# EAGLE design M5_Access_Switch_Output (EAGLE 9.6.2)
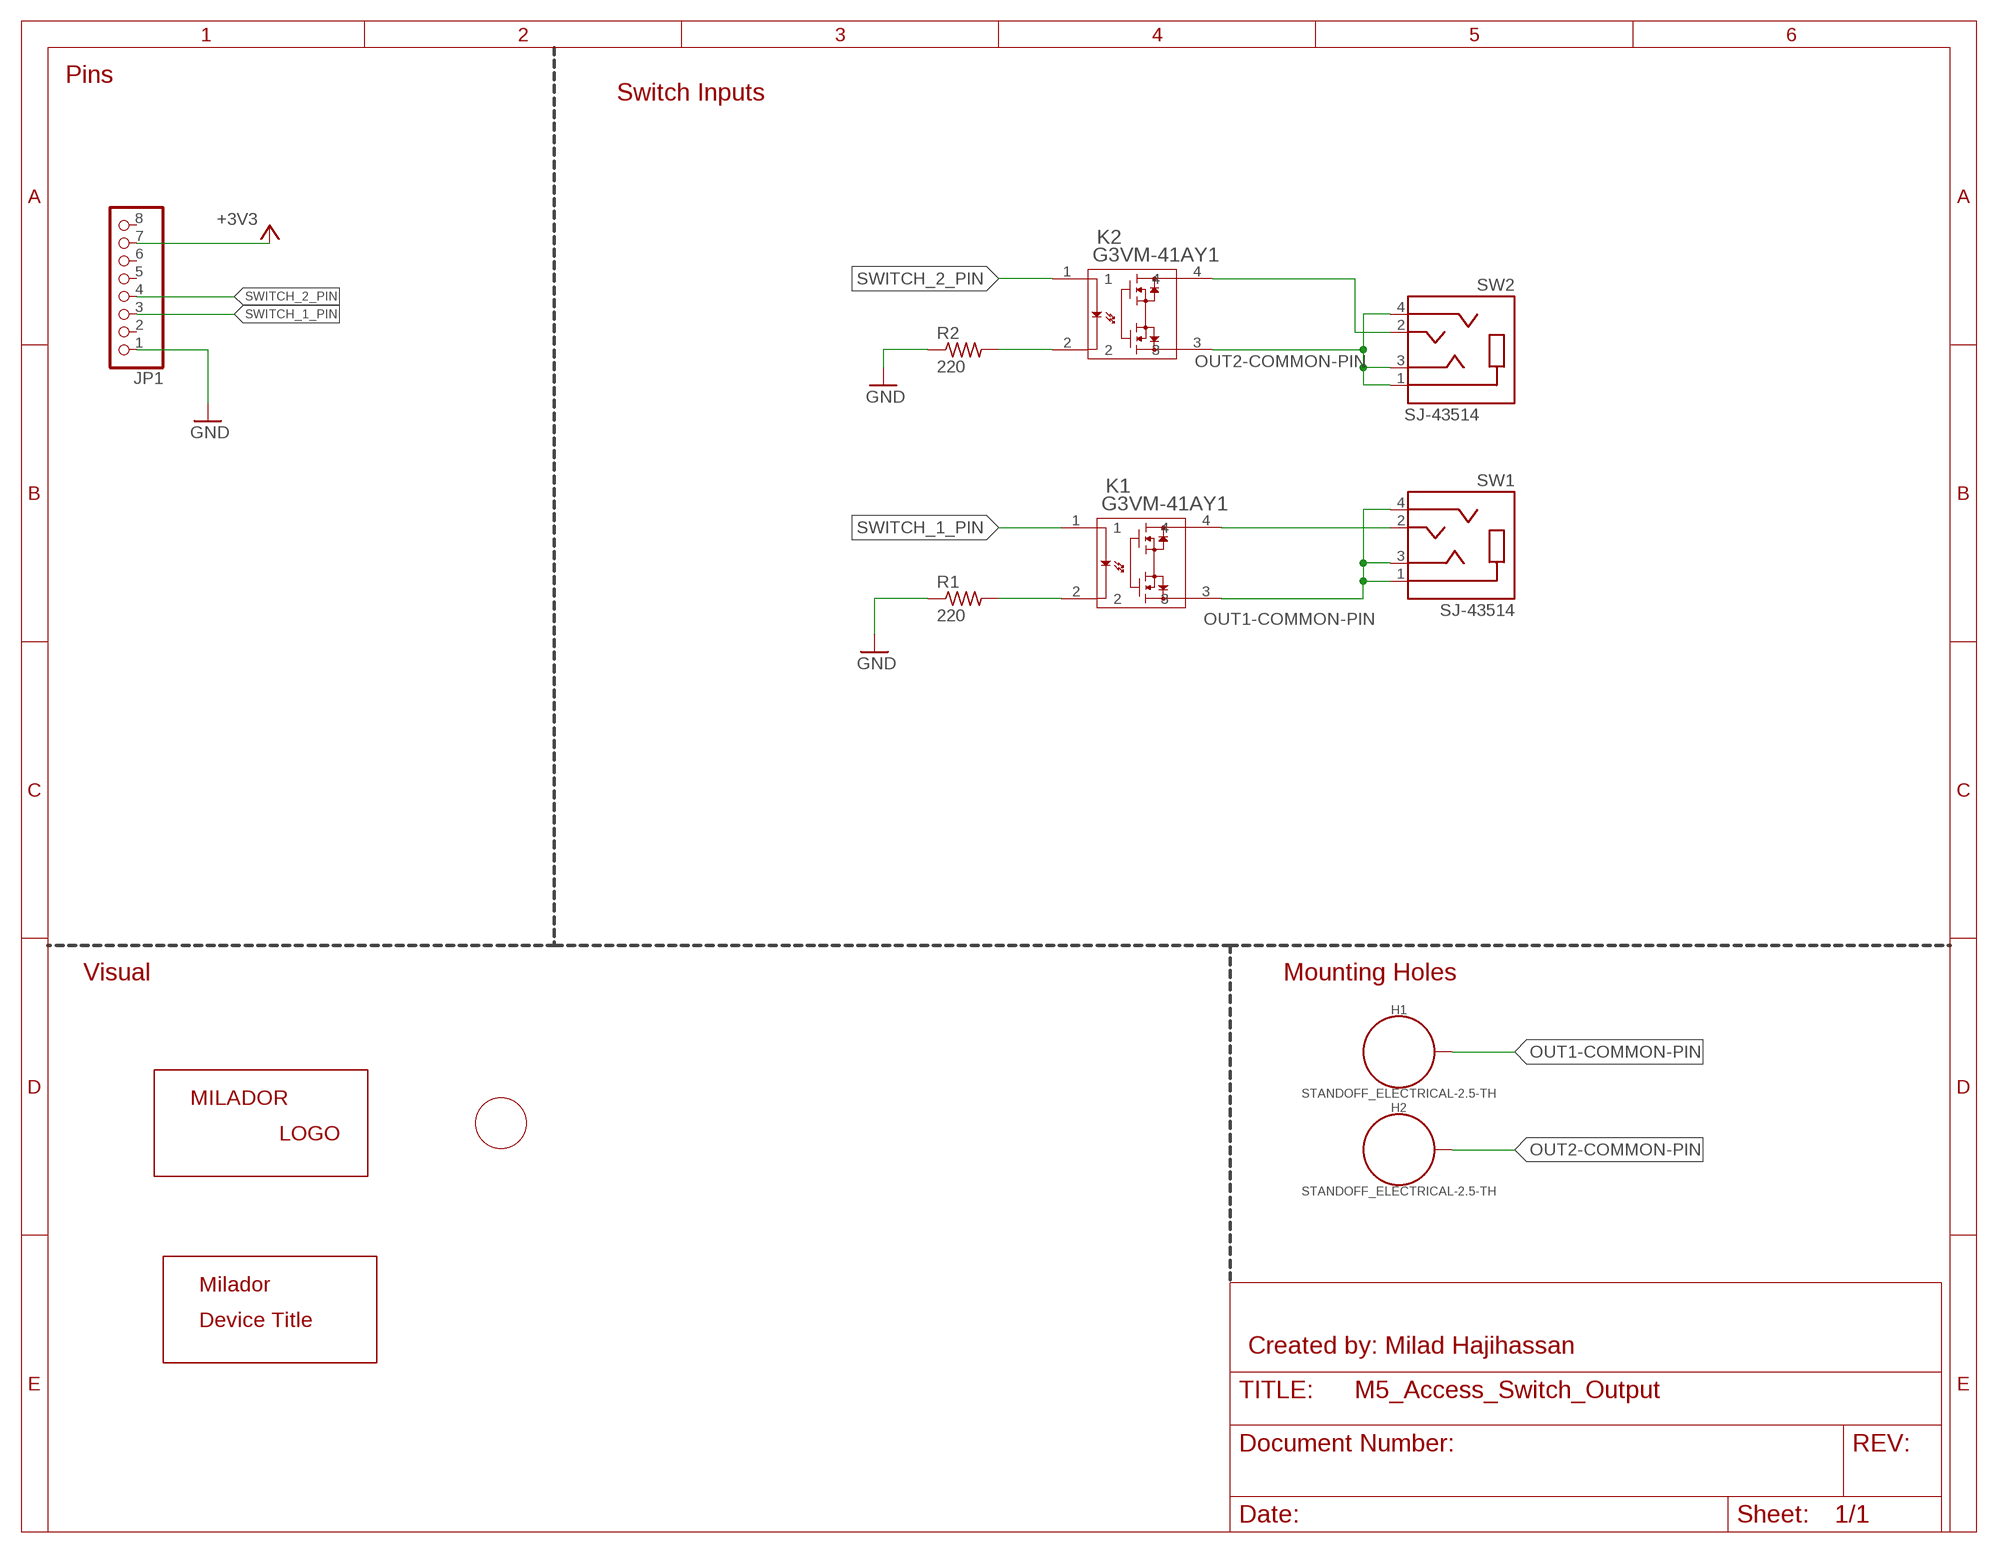
[diagram p0: schematic, sheet 1]

## Parts
H1  STANDOFF_ELECTRICAL-2.5-TH  [STANDOFF-ELECTRICAL-2.5-TH]
H2  STANDOFF_ELECTRICAL-2.5-TH  [STANDOFF-ELECTRICAL-2.5-TH]
JP1  HEADER_MALE-1X8ROUND-RA  [1X08_ROUND_RA]
K1  G3VM-41AY1  [A-DIP4_THD_OMR]
K2  G3VM-41AY1  [A-DIP4_THD_OMR]
LABEL_DEVICE_TOP  MILADOR-DEVICE-M5-ACCESS-SWITCH  [MILADOR_M5_ACCESS_SWITCH]
LABEL_LOGO_TOP  MILADOR-LOGO-SM  [MILADOR_LOGO2]
LABEL_OUTPUT_TOP  MILADOR-SWITCH-NAME-SW-OUTPUT  [SWITCH-OUTPUT]
R1  220  RESISTOR-US-0204/5  [RESISTOR_0204/5]
R2  220  RESISTOR-US-0204/5  [RESISTOR_0204/5]
SW1  SJ-43514  [CUI_SJ-43514]
SW2  SJ-43514  [CUI_SJ-43514]

## Nets
+3V3: JP1.7
GND: JP1.1 R1.1 R2.1
N$2: K2.2 R2.2
N$3: K1.2 R1.2
OUT1-COMMON-PIN: H1.P1 K1.3 SW1.1(SLEEVE) SW1.3(RING1) SW1.4(RING2)
OUT2-COMMON-PIN: H2.P1 K2.3 SW2.1(SLEEVE) SW2.3(RING1) SW2.4(RING2)
OUT-1-PIN: K2.4 SW2.2(TIP)
OUT-2-PIN: K1.4 SW1.2(TIP)
SWITCH_1_PIN: JP1.3 K1.1
SWITCH_2_PIN: JP1.4 K2.1
Unconnected: JP1.2 JP1.5 JP1.6 JP1.8

## Notes on the sheet
- Pins
- Switch Inputs
- Visual | Mounting Holes
- Created by: Milad Hajihassan

## Library data of the parts
H1 H2 = milador:STANDOFF_ELECTRICAL: Stand Off Drill holes with an electrical connection. For example, use these to ground your board to a chassis. Example SparkFun Products Screw - Phillips Head (1/4", 4-40, 10 pack) <https://www.sparkfun.com/products/10453> (PRT-10453) Screw - Phillips Head (1/2", 4-40, 10 pack) <https://www.sparkfun.com/products/10452> (PRT-10452) Screw - Phillips Head (3/4", 4-40, 10 pack) <https://www.sparkfun.com/products/10451> (PRT-10451) Screw - Phillips Head (1", 4-40, 10 pack) <https://www.sparkfun.com/products/10450> (PRT-10450)
JP1 = milador:HEADER_MALE-1X8: PIN HEADER
K1 K2 = milador:G3VM-41AY1; COPYRIGHT: Copyright (C) 2022 Ultra Librarian. All rights reserved.; DIGI-KEY_PART_NUMBER_1: Z5417-ND; MANUFACTURER_PART_NUMBER: G3VM-41AY1; MFR_NAME: Omron
LABEL_DEVICE_TOP = milador:MILADOR-DEVICE-
LABEL_LOGO_TOP = milador:MILADOR-LOGO-
LABEL_OUTPUT_TOP = milador:MILADOR-SWITCH-NAME-
R1 R2 = milador:RESISTOR-US-: RESISTOR, American symbol
SW1 SW2 = milador:SJ-43514

## Board
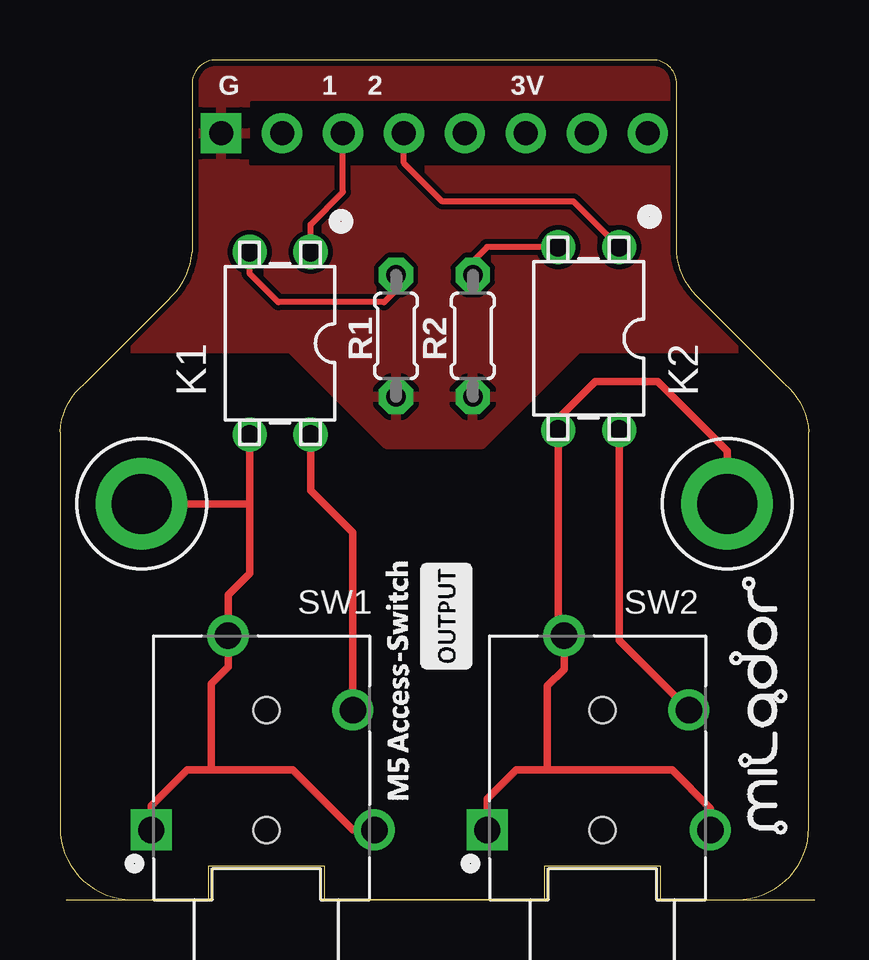
[diagram p1: board, top side]
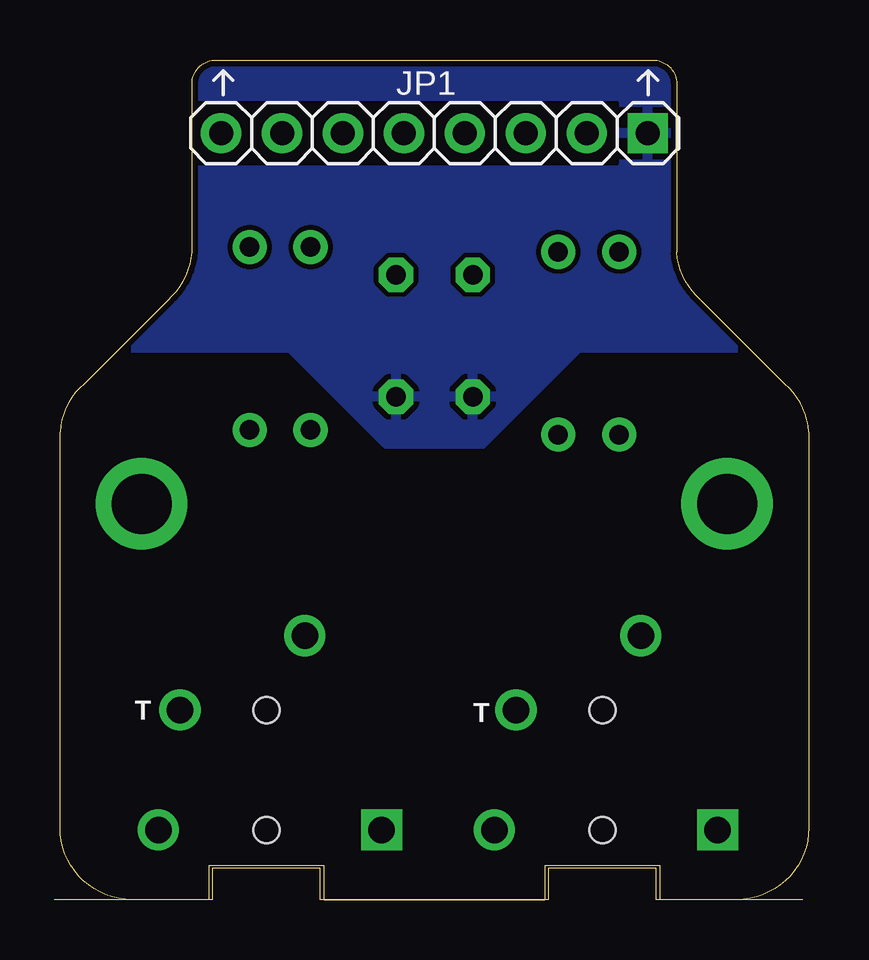
[diagram p2: board, bottom side, seen from below]

Size 31.2 x 35 mm. Coordinates in mm from the lower left corner, seen from the top.
Outline: 3,0 6.2,0 6.2,1.4 11,1.4 11,0 20.2,0 20.2,1.4 25,1.4 25,0 28.2,0 arc90 31.2,3 31.2,19.5 arc45 30.2,21.5 26.7,25 arc-45 25.7,27 25.7,34 arc90 24.7,35 6.5,35 arc90 5.5,34 5.5,27 arc-45 4.5,25 1,21.5 arc45 0,19.5 0,3 arc90 3,0
Copper layers (1*16): Top 0.035mm / dielectric 1.5mm / Bottom 0.035mm
Design rules "SparkFun": minimum track width 8mil, minimum drill 20mil, track to track 8mil, track to pad 8mil, pad to pad 8mil, via to via 8mil, smd to smd 8mil, copper to edge 10mil, drill to drill 8mil, minimum pad ring 12mil, minimum via ring 10mil, stop-mask expansion 4mil, vias tented up to drill 25mil, thermal gap 10mil

### Footprints (pad centres in the part's own frame; a part is rotated, then mirrored left to right if it is on the bottom)
STANDOFF-ELECTRICAL-2.5-TH = drill 2.5 pad 3.81: P1 0,0
1X08_ROUND_RA = drill 1 pad 1.676 square: 1 -8.89,0 | drill 1 pad 1.676: 2 -6.35,0; 3 -3.81,0; 4 -1.27,0; 5 1.27,0; 6 3.81,0; 7 6.35,0; 8 8.89,0
A-DIP4_THD_OMR = drill 0.813 pad 1.321: 1 0,0; 2 0,-2.54; 3 7.62,-2.54; 4 7.62,0
RESISTOR_0204/5 = drill 0.813 octagon: 1 -2.54,0; 2 2.54,0
CUI_SJ-43514 = drill 1.1 square: 1 -2.6,4.8 | drill 1.1: 2 2.4,-3.6; 3 5.5,1.6; 4 -2.6,-4.5 | hole 1.1: -2.6,0; 2.4,0

### Placement (x,y rotation side)
H1  3.4,16.5 0 top
H2  27.8,16.5 90 top
JP1  15.6,31.95 180 bottom
K1  10.44,27 270 top
K2  23.3,27.2 270 top
LABEL_DEVICE_TOP  14.2,9.1 90 top
LABEL_LOGO_TOP  29.6,7.4 90 top
LABEL_OUTPUT_TOP  16.1,11.8 90 top
R1  14,23.5 90 top
R2  17.2,23.5 90 top
SW1  8.6,5.5 90 top
SW2  22.6,5.5 90 top

### Tracks (layer width: path | path; a pad name or v marks a point on that pad's centre or on a via)
GND
  pour Bottom: 13.6,19 17.6,19 21.6,23 31.2,23 31.2,35 25.7,35 5.5,35 0,35 0,23 9.6,23
  pour Top: 9.6,23 13.6,19 17.6,19 21.6,23 31.2,23 31.2,35 0,35 0,23
  cutout Top: 7.98,30.67 7.98,33.22 25.7,33.22 25.7,30.68 7.94,30.68
  cutout Bottom: 7.98,33.22 25.7,33.22 25.7,30.68 7.98,30.68
N$2
  Top 0.254: K2.2 17.8,27.2 17.2,26.6 R2.2
N$3
  Top 0.254: R1.2 14,25.4 13.5,24.9 9.1,24.9 7.9,26.1 K1.2
OUT1-COMMON-PIN
  Top 0.305: SW1.4 12.2,2.9 9.7,5.4 6.3,5.4 | SW1.1 3.8,3.9 5.3,5.4 6.3,5.4 | 6.3,5.4 6.3,9 7,9.7 SW1.3 7,12.7 7.9,13.6 7.9,16.5 | 7.9,16.5 K1.3 | H1.P1 7.9,16.5
OUT2-COMMON-PIN
  Top 0.305: H2.P1 27.8,18.7 24.9,21.6 22.3,21.6 20.76,20.06 K2.3 20.76,11.64 21,11.4 SW2.3 21,9.6 20.3,8.9 20.3,5.4 | SW2.4 27.1,3.8 25.5,5.4 20.3,5.4 | SW2.1 17.8,4.2 19,5.4 20.3,5.4
OUT-1-PIN
  Top 0.305: SW2.2 23.3,10.8 K2.4
OUT-2-PIN
  Top 0.305: SW1.2 12.2,15.3 10.44,17.06 K1.4
SWITCH_1_PIN
  Top 0.254: K1.1 10.44,28.14 11.79,29.49 JP1.3
SWITCH_2_PIN
  Top 0.254: JP1.4 14.33,30.7 15.93,29.1 21.4,29.1 K2.1

### Text on the board
tPlace: G 1 2 3V
bPlace: T | T